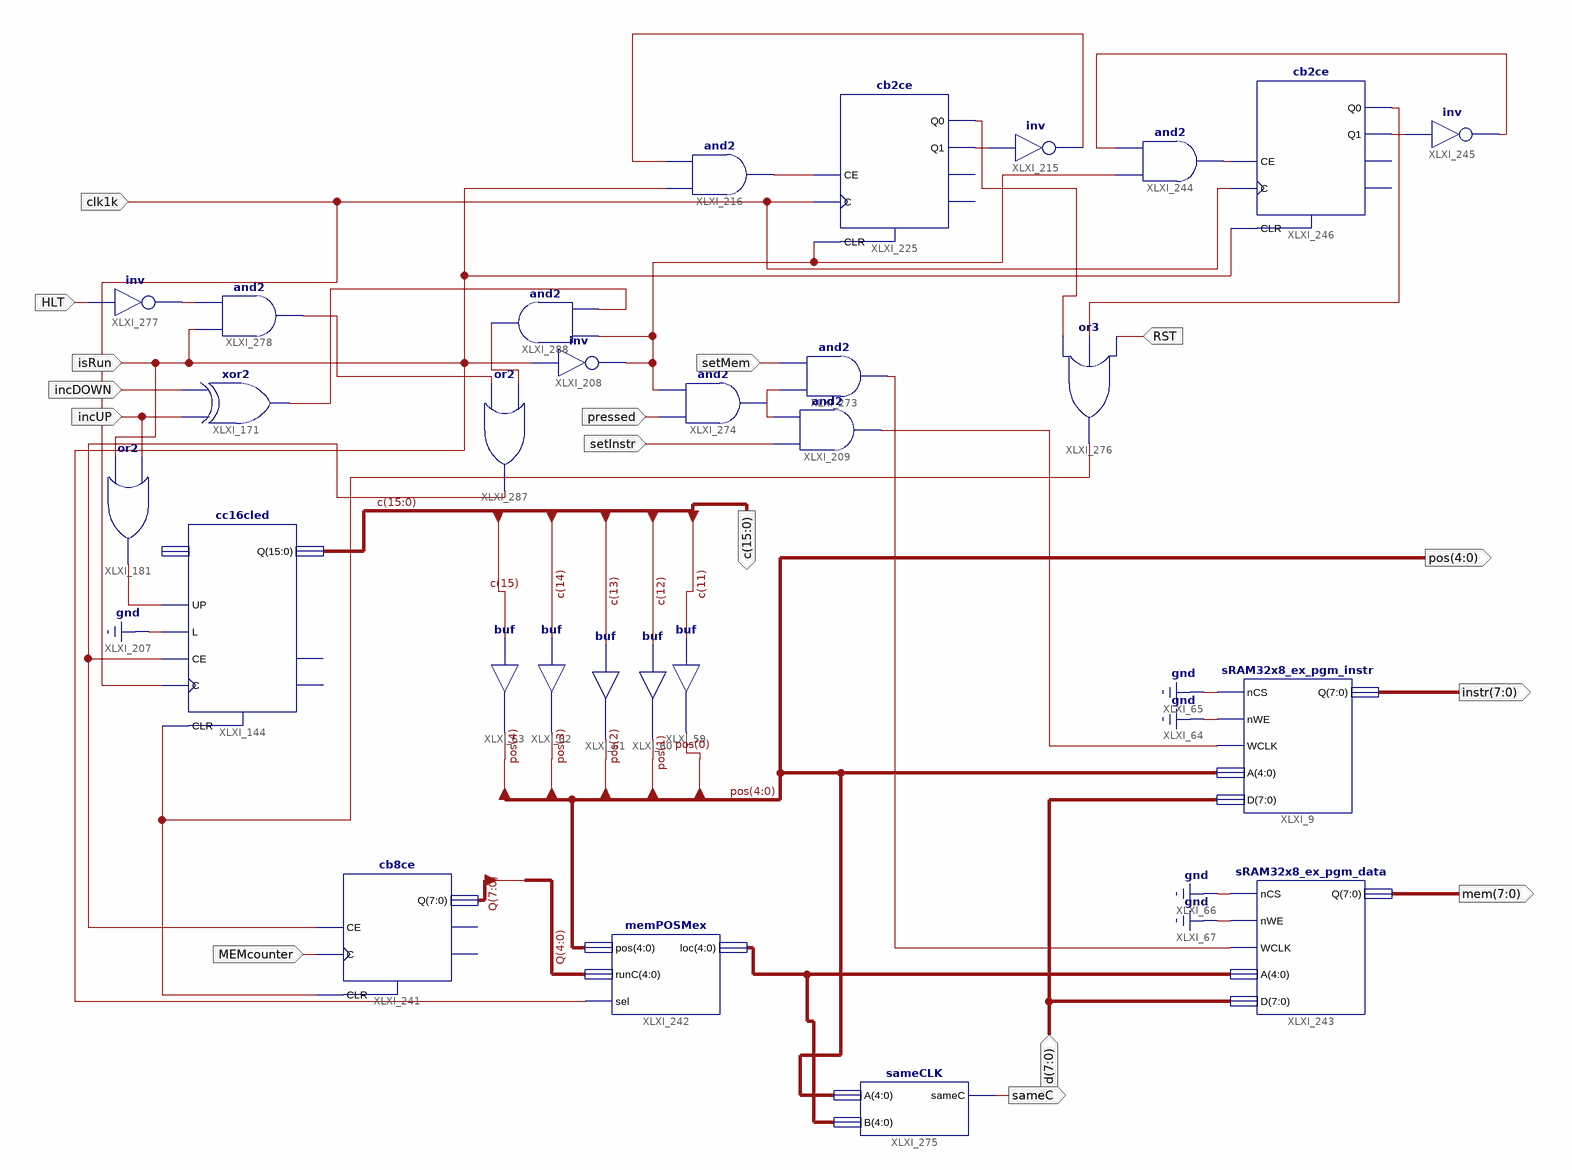
[diagram p0: schematic sheet 1]
// Xilinx ISE schematic mainClock.sch (spartan3e) as structural Verilog: 28 symbols, 16 ports
module mainClock (
  input  clk1k,
  input  incDOWN,
  input  incUP,
  input  isRun,
  input  setInstr,
  input  MEMcounter,
  input  [7:0] d,
  input  setMem,
  input  pressed,
  input  RST,
  input  HLT,
  output [15:0] c,
  output [4:0] pos,
  output [7:0] mem,
  output [7:0] instr,
  output sameC
);

  wire XLXN_276, XLXN_281, XLXN_333, XLXN_335, XLXN_348, XLXN_389, XLXN_390, XLXN_391, XLXN_402, XLXN_403,
       XLXN_404, XLXN_447, XLXN_448, XLXN_449, XLXN_450, XLXN_456, XLXN_462, XLXN_464, XLXN_465;
  wire [4:0] XLXN_380;
  wire [7:0] Q;

  buf XLXI_63 (pos[4], c[15]);
  buf XLXI_62 (pos[3], c[14]);
  buf XLXI_61 (pos[2], c[13]);
  buf XLXI_60 (pos[1], c[12]);
  buf XLXI_59 (pos[0], c[11]);
  cc16cled XLXI_144 (.C(clk1k), .CE(XLXN_276), .CLR(XLXN_404), .L(1'b0), .UP(XLXN_281), .Q(c));  // open: D, CEO, TC
  xor XLXI_171 (XLXN_464, incUP, incDOWN);
  or XLXI_181 (XLXN_281, isRun, incUP);
  not XLXI_208 (XLXN_449, isRun);
  and XLXI_209 (XLXN_448, setInstr, XLXN_450);
  and XLXI_216 (XLXN_335, isRun, XLXN_348);
  not XLXI_215 (XLXN_348, XLXN_333);
  cb2ce XLXI_225 (.C(clk1k), .CE(XLXN_335), .CLR(XLXN_449), .Q0(XLXN_402), .Q1(XLXN_333));  // open: CEO, TC
  cb8ce XLXI_241 (.C(MEMcounter), .CE(XLXN_276), .CLR(XLXN_404), .Q(Q));  // open: CEO, TC
  memPOSMex XLXI_242 (.pos(pos), .runC(Q[4:0]), .sel(isRun), .loc(XLXN_380));
  not XLXI_245 (XLXN_391, XLXN_389);
  cb2ce XLXI_246 (.C(clk1k), .CE(XLXN_390), .CLR(isRun), .Q0(XLXN_403), .Q1(XLXN_389));  // open: CEO, TC
  and XLXI_244 (XLXN_390, XLXN_449, XLXN_391);
  sRAM32x8_ex_pgm_data XLXI_243 (.nCS(1'b0), .nWE(1'b0), .WCLK(XLXN_447), .A(XLXN_380), .D(d), .Q(mem));
  sRAM32x8_ex_pgm_instr XLXI_9 (.nCS(1'b0), .nWE(1'b0), .WCLK(XLXN_448), .A(pos), .D(d), .Q(instr));
  and XLXI_273 (XLXN_447, XLXN_450, setMem);
  and XLXI_274 (XLXN_450, pressed, XLXN_449);
  sameCLK XLXI_275 (.A(pos), .B(XLXN_380), .sameC(sameC));
  or XLXI_276 (XLXN_404, XLXN_402, XLXN_403, RST);
  not XLXI_277 (XLXN_456, HLT);
  and XLXI_278 (XLXN_465, isRun, XLXN_456);
  or XLXI_287 (XLXN_276, XLXN_465, XLXN_462);
  and XLXI_288 (XLXN_462, XLXN_464, XLXN_449);
endmodule
